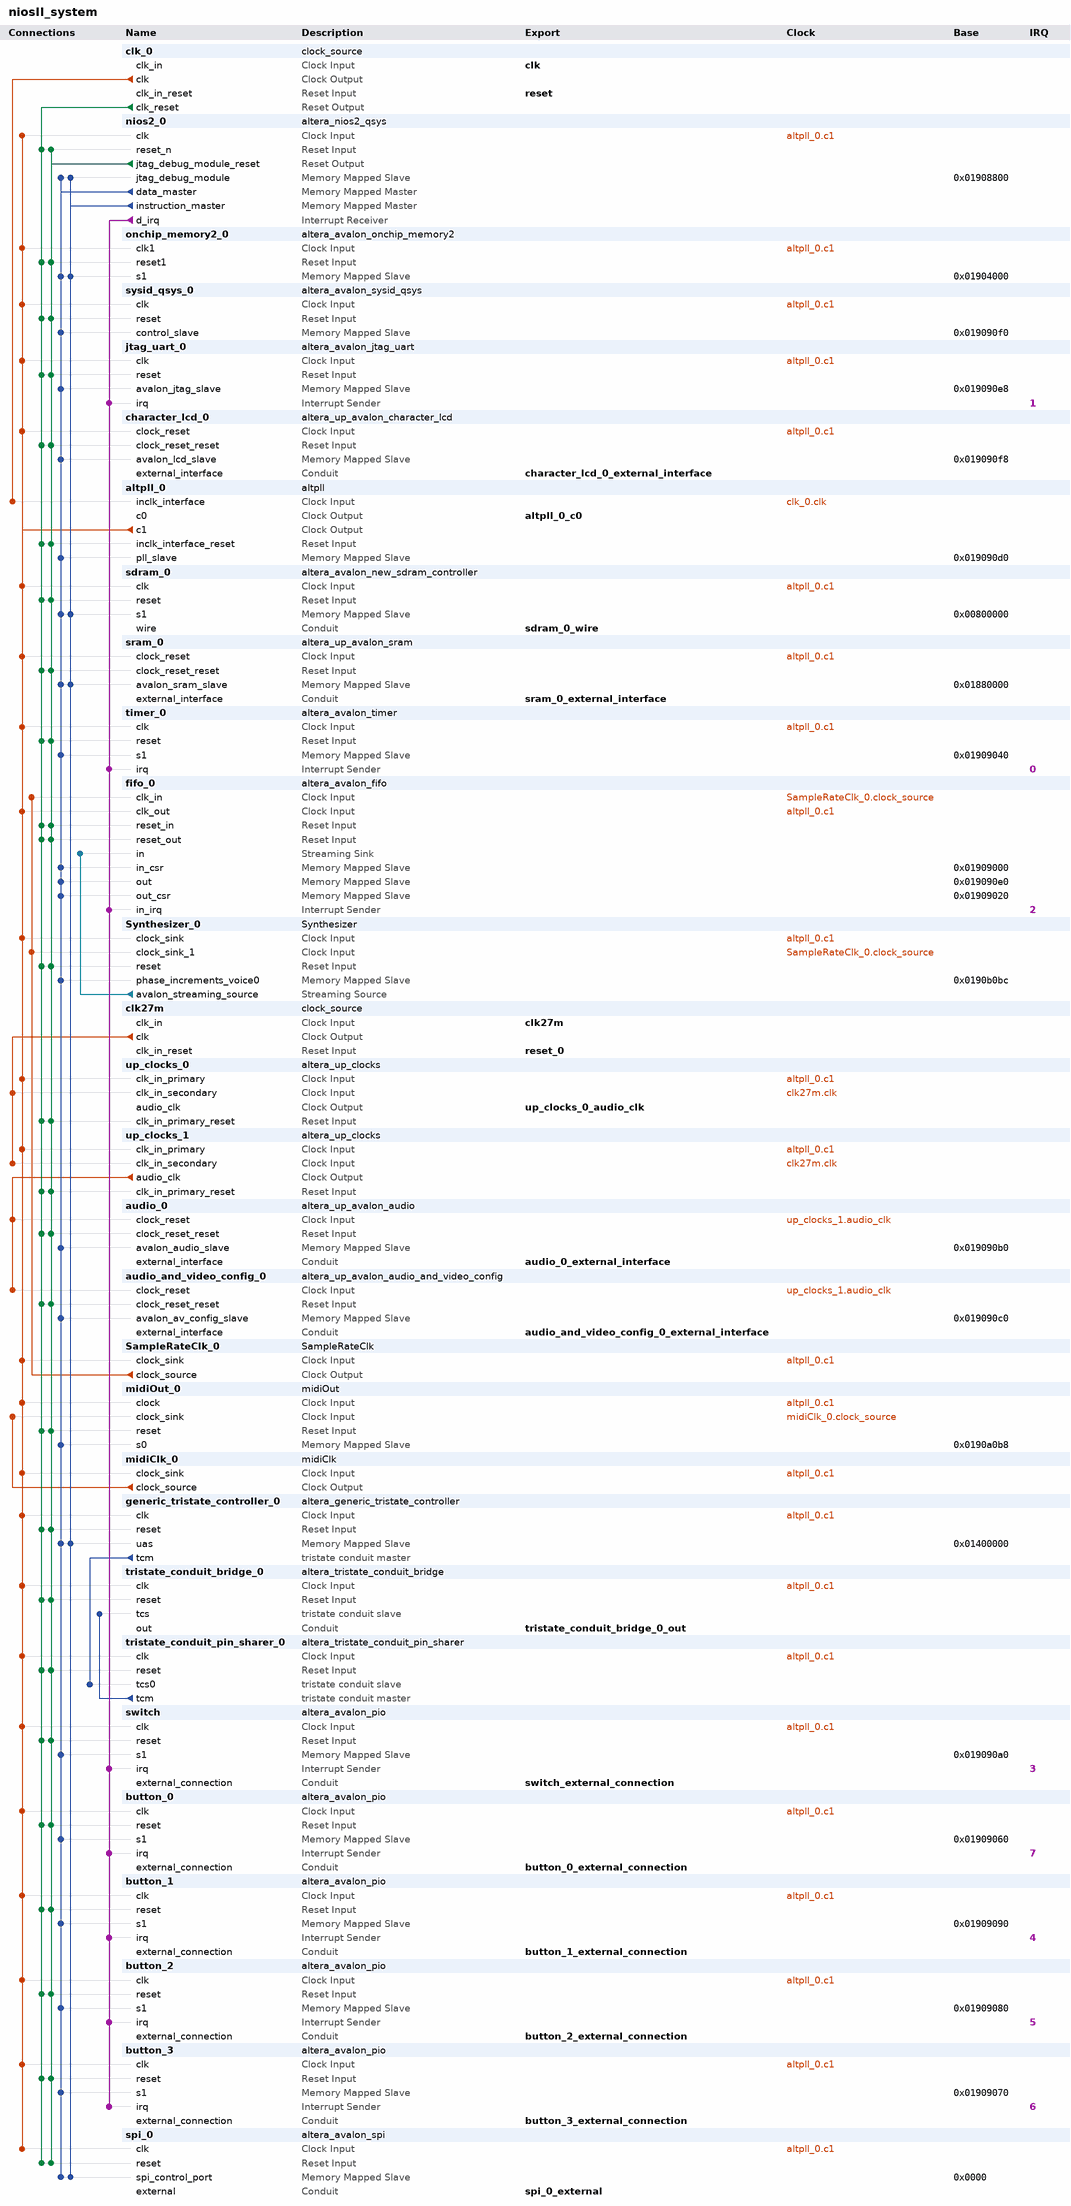
[diagram p0: system contents]
# Platform Designer (Qsys) system niosII_system, Cyclone II EP2C35F672C6
# Parameters at their usual value, and those the tool derives, are not listed.
package require -exact qsys 12.1
create_system niosII_system
set_project_property DEVICE_FAMILY {Cyclone II}
set_project_property DEVICE EP2C35F672C6

add_instance clk_0 clock_source 12.1
set_instance_parameter_value clk_0 clockFrequency 50000000

add_instance nios2_0 altera_nios2_qsys 12.1
set_instance_parameter_value nios2_0 resetSlave generic_tristate_controller_0.uas
set_instance_parameter_value nios2_0 exceptionSlave onchip_memory2_0.s1
set_instance_parameter_value nios2_0 breakSlave nios2_0.jtag_debug_module
set_instance_parameter_value nios2_0 impl Fast
set_instance_parameter_value nios2_0 icache_size 4096

add_instance onchip_memory2_0 altera_avalon_onchip_memory2 12.1
set_instance_parameter_value onchip_memory2_0 dataWidth 32
set_instance_parameter_value onchip_memory2_0 dualPort false
set_instance_parameter_value onchip_memory2_0 initMemContent true
set_instance_parameter_value onchip_memory2_0 initializationFileName onchip_memory2_0
set_instance_parameter_value onchip_memory2_0 memorySize 16384

add_instance sysid_qsys_0 altera_avalon_sysid_qsys 12.1
set_instance_parameter_value sysid_qsys_0 id 0

add_instance jtag_uart_0 altera_avalon_jtag_uart 12.1
set_instance_parameter_value jtag_uart_0 simInteractiveOptions INTERACTIVE_INPUT_OUTPUT

add_instance character_lcd_0 altera_up_avalon_character_lcd 12.0
set_instance_parameter_value character_lcd_0 cursor Normal

add_instance altpll_0 altpll 12.1
set_instance_parameter_value altpll_0 INCLK0_INPUT_FREQUENCY 20000
set_instance_parameter_value altpll_0 GATE_LOCK_SIGNAL NO
set_instance_parameter_value altpll_0 VALID_LOCK_MULTIPLIER 1
set_instance_parameter_value altpll_0 INVALID_LOCK_MULTIPLIER 5
set_instance_parameter_value altpll_0 CLK0_MULTIPLY_BY 1
set_instance_parameter_value altpll_0 CLK1_MULTIPLY_BY 1
set_instance_parameter_value altpll_0 CLK0_DIVIDE_BY 1
set_instance_parameter_value altpll_0 CLK1_DIVIDE_BY 1
set_instance_parameter_value altpll_0 CLK0_PHASE_SHIFT -3000
set_instance_parameter_value altpll_0 CLK1_PHASE_SHIFT 0
set_instance_parameter_value altpll_0 CLK1_DUTY_CYCLE 50
set_instance_parameter_value altpll_0 PORT_clk1 PORT_USED
set_instance_parameter_value altpll_0 PORT_clk2 PORT_UNUSED
set_instance_parameter_value altpll_0 PORT_clk3 PORT_UNUSED
set_instance_parameter_value altpll_0 PORT_ARESET PORT_UNUSED
set_instance_parameter_value altpll_0 PORT_LOCKED PORT_UNUSED

add_instance sdram_0 altera_avalon_new_sdram_controller 12.1
set_instance_parameter_value sdram_0 TAC 5.5
set_instance_parameter_value sdram_0 TRCD 20.0
set_instance_parameter_value sdram_0 TRP 20.0
set_instance_parameter_value sdram_0 casLatency 3
set_instance_parameter_value sdram_0 columnWidth 8
set_instance_parameter_value sdram_0 dataWidth 16
set_instance_parameter_value sdram_0 generateSimulationModel false
set_instance_parameter_value sdram_0 model custom
set_instance_parameter_value sdram_0 numberOfBanks 4
set_instance_parameter_value sdram_0 numberOfChipSelects 1
set_instance_parameter_value sdram_0 powerUpDelay 100.0
set_instance_parameter_value sdram_0 refreshPeriod 15.625
set_instance_parameter_value sdram_0 rowWidth 12

add_instance sram_0 altera_up_avalon_sram 12.0
set_instance_parameter_value sram_0 board DE2
set_instance_parameter_value sram_0 pixel_buffer false

add_instance timer_0 altera_avalon_timer 12.1
set_instance_parameter_value timer_0 period 1
set_instance_parameter_value timer_0 periodUnits MSEC
set_instance_parameter_value timer_0 timerPreset CUSTOM

add_instance fifo_0 altera_avalon_fifo 12.1
set_instance_parameter_value fifo_0 bitsPerSymbol 32
set_instance_parameter_value fifo_0 channelWidth 0
set_instance_parameter_value fifo_0 errorWidth 0
set_instance_parameter_value fifo_0 fifoDepth 128
set_instance_parameter_value fifo_0 fifoInputInterfaceOptions AVALONST_SINK
set_instance_parameter_value fifo_0 fifoOutputInterfaceOptions AVALONMM_READ
set_instance_parameter_value fifo_0 singleClockMode false
set_instance_parameter_value fifo_0 symbolsPerBeat 1
set_instance_parameter_value fifo_0 useBackpressure false
set_instance_parameter_value fifo_0 useIRQ true
set_instance_parameter_value fifo_0 usePacket false
set_instance_parameter_value fifo_0 useReadControl true

add_instance Synthesizer_0 Synthesizer 1.0

add_instance clk27m clock_source 12.1
set_instance_parameter_value clk27m clockFrequency 27000000

add_instance up_clocks_0 altera_up_clocks 12.0
set_instance_parameter_value up_clocks_0 board DE2
set_instance_parameter_value up_clocks_0 sdram_clk false
set_instance_parameter_value up_clocks_0 vga_clk false
set_instance_parameter_value up_clocks_0 audio_clk true
set_instance_parameter_value up_clocks_0 audio_clk_freq 12.288

add_instance up_clocks_1 altera_up_clocks 12.0
set_instance_parameter_value up_clocks_1 board DE2
set_instance_parameter_value up_clocks_1 sdram_clk false
set_instance_parameter_value up_clocks_1 vga_clk false
set_instance_parameter_value up_clocks_1 audio_clk true
set_instance_parameter_value up_clocks_1 audio_clk_freq 12.288

add_instance audio_0 altera_up_avalon_audio 12.0
set_instance_parameter_value audio_0 avalon_bus_type {Memory Mapped}
set_instance_parameter_value audio_0 audio_in true
set_instance_parameter_value audio_0 dw 16

add_instance audio_and_video_config_0 altera_up_avalon_audio_and_video_config 12.0
set_instance_parameter_value audio_and_video_config_0 board DE2
set_instance_parameter_value audio_and_video_config_0 audio_in {Microphone to ADC}
set_instance_parameter_value audio_and_video_config_0 line_in_bypass false
set_instance_parameter_value audio_and_video_config_0 bit_length 16
set_instance_parameter_value audio_and_video_config_0 sampling_rate {32 kHz}

add_instance SampleRateClk_0 SampleRateClk 1.0

add_instance midiOut_0 midiOut 1.0

add_instance midiClk_0 midiClk 1.0

add_instance generic_tristate_controller_0 altera_generic_tristate_controller 12.1
set_instance_parameter_value generic_tristate_controller_0 TCM_ADDRESS_W 22
set_instance_parameter_value generic_tristate_controller_0 TCM_DATA_W 8
set_instance_parameter_value generic_tristate_controller_0 TCM_BYTEENABLE_W 1
set_instance_parameter_value generic_tristate_controller_0 TCM_READ_WAIT 160
set_instance_parameter_value generic_tristate_controller_0 TCM_WRITE_WAIT 160
set_instance_parameter_value generic_tristate_controller_0 TCM_SETUP_WAIT 40
set_instance_parameter_value generic_tristate_controller_0 TCM_DATA_HOLD 40
set_instance_parameter_value generic_tristate_controller_0 TCM_MAX_PENDING_READ_TRANSACTIONS 3
set_instance_parameter_value generic_tristate_controller_0 TCM_TURNAROUND_TIME 2
set_instance_parameter_value generic_tristate_controller_0 TCM_TIMING_UNITS 0
set_instance_parameter_value generic_tristate_controller_0 TCM_READLATENCY 2
set_instance_parameter_value generic_tristate_controller_0 TCM_SYMBOLS_PER_WORD 1
set_instance_parameter_value generic_tristate_controller_0 USE_READ 1
set_instance_parameter_value generic_tristate_controller_0 USE_BEGINTRANSFER 0
set_instance_parameter_value generic_tristate_controller_0 USE_BYTEENABLE 0
set_instance_parameter_value generic_tristate_controller_0 USE_OUTPUTENABLE 0
set_instance_parameter_value generic_tristate_controller_0 ACTIVE_LOW_READ 1
set_instance_parameter_value generic_tristate_controller_0 ACTIVE_LOW_BYTEENABLE 0
set_instance_parameter_value generic_tristate_controller_0 ACTIVE_LOW_OUTPUTENABLE 0
set_instance_parameter_value generic_tristate_controller_0 ACTIVE_LOW_BEGINTRANSFER 0
set_instance_parameter_value generic_tristate_controller_0 CHIPSELECT_THROUGH_READLATENCY 0
set_instance_parameter_value generic_tristate_controller_0 MODULE_ASSIGNMENT_KEYS embeddedsw.configuration.hwClassnameDriverSupportList,embeddedsw.configuration.isFlash,embeddedsw.configuration.isMemoryDevice,embeddedsw.configuration.isNonVolatileStorage
set_instance_parameter_value generic_tristate_controller_0 MODULE_ASSIGNMENT_VALUES "altera_avalon_lan91c111\\,altera_avalon_cfi_flash,1,1,1"
set_instance_parameter_value generic_tristate_controller_0 INTERFACE_ASSIGNMENT_KEYS embeddedsw.configuration.isFlash,embeddedsw.configuration.isMemoryDevice,embeddedsw.configuration.isNonVolatileStorage
set_instance_parameter_value generic_tristate_controller_0 INTERFACE_ASSIGNMENT_VALUES 1,1,1

add_instance tristate_conduit_bridge_0 altera_tristate_conduit_bridge 12.1

add_instance tristate_conduit_pin_sharer_0 altera_tristate_conduit_pin_sharer 12.1
set_instance_parameter_value tristate_conduit_pin_sharer_0 NUM_INTERFACES 1

add_instance switch altera_avalon_pio 12.1
set_instance_parameter_value switch captureEdge true
set_instance_parameter_value switch direction Input
set_instance_parameter_value switch edgeType ANY
set_instance_parameter_value switch generateIRQ true
set_instance_parameter_value switch irqType EDGE
set_instance_parameter_value switch width 8

add_instance button_0 altera_avalon_pio 12.1
set_instance_parameter_value button_0 captureEdge true
set_instance_parameter_value button_0 direction Input
set_instance_parameter_value button_0 edgeType FALLING
set_instance_parameter_value button_0 generateIRQ true
set_instance_parameter_value button_0 width 1

add_instance button_1 altera_avalon_pio 12.1
set_instance_parameter_value button_1 captureEdge true
set_instance_parameter_value button_1 direction Input
set_instance_parameter_value button_1 edgeType FALLING
set_instance_parameter_value button_1 generateIRQ true
set_instance_parameter_value button_1 irqType EDGE
set_instance_parameter_value button_1 width 1

add_instance button_2 altera_avalon_pio 12.1
set_instance_parameter_value button_2 captureEdge true
set_instance_parameter_value button_2 direction Input
set_instance_parameter_value button_2 edgeType FALLING
set_instance_parameter_value button_2 generateIRQ true
set_instance_parameter_value button_2 irqType EDGE
set_instance_parameter_value button_2 width 1

add_instance button_3 altera_avalon_pio 12.1
set_instance_parameter_value button_3 captureEdge true
set_instance_parameter_value button_3 direction Input
set_instance_parameter_value button_3 edgeType FALLING
set_instance_parameter_value button_3 generateIRQ true
set_instance_parameter_value button_3 width 1

add_instance spi_0 altera_avalon_spi 12.1
set_instance_parameter_value spi_0 clockPolarity 0
set_instance_parameter_value spi_0 dataWidth 32
set_instance_parameter_value spi_0 masterSPI true
set_instance_parameter_value spi_0 numberOfSlaves 1
set_instance_parameter_value spi_0 targetClockRate 128000

# connections
add_connection altpll_0.c1 button_0.clk clock
add_connection altpll_0.c1 button_1.clk clock
add_connection altpll_0.c1 button_2.clk clock
add_connection altpll_0.c1 button_3.clk clock
add_connection altpll_0.c1 character_lcd_0.clock_reset clock
add_connection altpll_0.c1 fifo_0.clk_out clock
add_connection altpll_0.c1 generic_tristate_controller_0.clk clock
add_connection altpll_0.c1 jtag_uart_0.clk clock
add_connection altpll_0.c1 midiClk_0.clock_sink clock
add_connection altpll_0.c1 midiOut_0.clock clock
add_connection altpll_0.c1 nios2_0.clk clock
add_connection altpll_0.c1 onchip_memory2_0.clk1 clock
add_connection altpll_0.c1 SampleRateClk_0.clock_sink clock
add_connection altpll_0.c1 sdram_0.clk clock
add_connection altpll_0.c1 spi_0.clk clock
add_connection altpll_0.c1 sram_0.clock_reset clock
add_connection altpll_0.c1 switch.clk clock
add_connection altpll_0.c1 Synthesizer_0.clock_sink clock
add_connection altpll_0.c1 sysid_qsys_0.clk clock
add_connection altpll_0.c1 timer_0.clk clock
add_connection altpll_0.c1 tristate_conduit_bridge_0.clk clock
add_connection altpll_0.c1 tristate_conduit_pin_sharer_0.clk clock
add_connection altpll_0.c1 up_clocks_0.clk_in_primary clock
add_connection altpll_0.c1 up_clocks_1.clk_in_primary clock
add_connection clk27m.clk up_clocks_0.clk_in_secondary clock
add_connection clk27m.clk up_clocks_1.clk_in_secondary clock
add_connection clk_0.clk altpll_0.inclk_interface clock
add_connection midiClk_0.clock_source midiOut_0.clock_sink clock
add_connection SampleRateClk_0.clock_source fifo_0.clk_in clock
add_connection SampleRateClk_0.clock_source Synthesizer_0.clock_sink_1 clock
add_connection up_clocks_1.audio_clk audio_0.clock_reset clock
add_connection up_clocks_1.audio_clk audio_and_video_config_0.clock_reset clock
add_connection clk_0.clk_reset altpll_0.inclk_interface_reset reset
add_connection clk_0.clk_reset audio_0.clock_reset_reset reset
add_connection clk_0.clk_reset audio_and_video_config_0.clock_reset_reset reset
add_connection clk_0.clk_reset button_0.reset reset
add_connection clk_0.clk_reset button_1.reset reset
add_connection clk_0.clk_reset button_2.reset reset
add_connection clk_0.clk_reset button_3.reset reset
add_connection clk_0.clk_reset character_lcd_0.clock_reset_reset reset
add_connection clk_0.clk_reset fifo_0.reset_in reset
add_connection clk_0.clk_reset fifo_0.reset_out reset
add_connection clk_0.clk_reset generic_tristate_controller_0.reset reset
add_connection clk_0.clk_reset jtag_uart_0.reset reset
add_connection clk_0.clk_reset midiOut_0.reset reset
add_connection clk_0.clk_reset nios2_0.reset_n reset
add_connection clk_0.clk_reset onchip_memory2_0.reset1 reset
add_connection clk_0.clk_reset sdram_0.reset reset
add_connection clk_0.clk_reset spi_0.reset reset
add_connection clk_0.clk_reset sram_0.clock_reset_reset reset
add_connection clk_0.clk_reset switch.reset reset
add_connection clk_0.clk_reset Synthesizer_0.reset reset
add_connection clk_0.clk_reset sysid_qsys_0.reset reset
add_connection clk_0.clk_reset timer_0.reset reset
add_connection clk_0.clk_reset tristate_conduit_bridge_0.reset reset
add_connection clk_0.clk_reset tristate_conduit_pin_sharer_0.reset reset
add_connection clk_0.clk_reset up_clocks_0.clk_in_primary_reset reset
add_connection clk_0.clk_reset up_clocks_1.clk_in_primary_reset reset
add_connection nios2_0.jtag_debug_module_reset altpll_0.inclk_interface_reset reset
add_connection nios2_0.jtag_debug_module_reset audio_0.clock_reset_reset reset
add_connection nios2_0.jtag_debug_module_reset audio_and_video_config_0.clock_reset_reset reset
add_connection nios2_0.jtag_debug_module_reset button_0.reset reset
add_connection nios2_0.jtag_debug_module_reset button_1.reset reset
add_connection nios2_0.jtag_debug_module_reset button_2.reset reset
add_connection nios2_0.jtag_debug_module_reset button_3.reset reset
add_connection nios2_0.jtag_debug_module_reset character_lcd_0.clock_reset_reset reset
add_connection nios2_0.jtag_debug_module_reset fifo_0.reset_in reset
add_connection nios2_0.jtag_debug_module_reset fifo_0.reset_out reset
add_connection nios2_0.jtag_debug_module_reset generic_tristate_controller_0.reset reset
add_connection nios2_0.jtag_debug_module_reset jtag_uart_0.reset reset
add_connection nios2_0.jtag_debug_module_reset midiOut_0.reset reset
add_connection nios2_0.jtag_debug_module_reset nios2_0.reset_n reset
add_connection nios2_0.jtag_debug_module_reset onchip_memory2_0.reset1 reset
add_connection nios2_0.jtag_debug_module_reset sdram_0.reset reset
add_connection nios2_0.jtag_debug_module_reset spi_0.reset reset
add_connection nios2_0.jtag_debug_module_reset sram_0.clock_reset_reset reset
add_connection nios2_0.jtag_debug_module_reset switch.reset reset
add_connection nios2_0.jtag_debug_module_reset Synthesizer_0.reset reset
add_connection nios2_0.jtag_debug_module_reset sysid_qsys_0.reset reset
add_connection nios2_0.jtag_debug_module_reset timer_0.reset reset
add_connection nios2_0.jtag_debug_module_reset tristate_conduit_bridge_0.reset reset
add_connection nios2_0.jtag_debug_module_reset tristate_conduit_pin_sharer_0.reset reset
add_connection nios2_0.jtag_debug_module_reset up_clocks_0.clk_in_primary_reset reset
add_connection nios2_0.jtag_debug_module_reset up_clocks_1.clk_in_primary_reset reset
add_connection nios2_0.data_master altpll_0.pll_slave avalon
set_connection_parameter_value nios2_0.data_master/altpll_0.pll_slave baseAddress 0x019090d0
add_connection nios2_0.data_master audio_0.avalon_audio_slave avalon
set_connection_parameter_value nios2_0.data_master/audio_0.avalon_audio_slave baseAddress 0x019090b0
add_connection nios2_0.data_master audio_and_video_config_0.avalon_av_config_slave avalon
set_connection_parameter_value nios2_0.data_master/audio_and_video_config_0.avalon_av_config_slave baseAddress 0x019090c0
add_connection nios2_0.data_master button_0.s1 avalon
set_connection_parameter_value nios2_0.data_master/button_0.s1 baseAddress 0x01909060
add_connection nios2_0.data_master button_1.s1 avalon
set_connection_parameter_value nios2_0.data_master/button_1.s1 baseAddress 0x01909090
add_connection nios2_0.data_master button_2.s1 avalon
set_connection_parameter_value nios2_0.data_master/button_2.s1 baseAddress 0x01909080
add_connection nios2_0.data_master button_3.s1 avalon
set_connection_parameter_value nios2_0.data_master/button_3.s1 baseAddress 0x01909070
add_connection nios2_0.data_master character_lcd_0.avalon_lcd_slave avalon
set_connection_parameter_value nios2_0.data_master/character_lcd_0.avalon_lcd_slave baseAddress 0x019090f8
add_connection nios2_0.data_master fifo_0.in_csr avalon
set_connection_parameter_value nios2_0.data_master/fifo_0.in_csr baseAddress 0x01909000
add_connection nios2_0.data_master fifo_0.out avalon
set_connection_parameter_value nios2_0.data_master/fifo_0.out baseAddress 0x019090e0
add_connection nios2_0.data_master fifo_0.out_csr avalon
set_connection_parameter_value nios2_0.data_master/fifo_0.out_csr baseAddress 0x01909020
add_connection nios2_0.data_master generic_tristate_controller_0.uas avalon
set_connection_parameter_value nios2_0.data_master/generic_tristate_controller_0.uas baseAddress 0x01400000
add_connection nios2_0.data_master jtag_uart_0.avalon_jtag_slave avalon
set_connection_parameter_value nios2_0.data_master/jtag_uart_0.avalon_jtag_slave baseAddress 0x019090e8
add_connection nios2_0.data_master midiOut_0.s0 avalon
set_connection_parameter_value nios2_0.data_master/midiOut_0.s0 baseAddress 0x0190a0b8
add_connection nios2_0.data_master nios2_0.jtag_debug_module avalon
set_connection_parameter_value nios2_0.data_master/nios2_0.jtag_debug_module baseAddress 0x01908800
add_connection nios2_0.data_master onchip_memory2_0.s1 avalon
set_connection_parameter_value nios2_0.data_master/onchip_memory2_0.s1 baseAddress 0x01904000
add_connection nios2_0.data_master sdram_0.s1 avalon
set_connection_parameter_value nios2_0.data_master/sdram_0.s1 baseAddress 0x00800000
add_connection nios2_0.data_master spi_0.spi_control_port avalon
set_connection_parameter_value nios2_0.data_master/spi_0.spi_control_port baseAddress 0x0000
add_connection nios2_0.data_master sram_0.avalon_sram_slave avalon
set_connection_parameter_value nios2_0.data_master/sram_0.avalon_sram_slave baseAddress 0x01880000
add_connection nios2_0.data_master switch.s1 avalon
set_connection_parameter_value nios2_0.data_master/switch.s1 baseAddress 0x019090a0
add_connection nios2_0.data_master Synthesizer_0.phase_increments_voice0 avalon
set_connection_parameter_value nios2_0.data_master/Synthesizer_0.phase_increments_voice0 baseAddress 0x0190b0bc
add_connection nios2_0.data_master sysid_qsys_0.control_slave avalon
set_connection_parameter_value nios2_0.data_master/sysid_qsys_0.control_slave baseAddress 0x019090f0
add_connection nios2_0.data_master timer_0.s1 avalon
set_connection_parameter_value nios2_0.data_master/timer_0.s1 baseAddress 0x01909040
add_connection nios2_0.instruction_master generic_tristate_controller_0.uas avalon
set_connection_parameter_value nios2_0.instruction_master/generic_tristate_controller_0.uas baseAddress 0x01400000
add_connection nios2_0.instruction_master nios2_0.jtag_debug_module avalon
set_connection_parameter_value nios2_0.instruction_master/nios2_0.jtag_debug_module baseAddress 0x01908800
add_connection nios2_0.instruction_master onchip_memory2_0.s1 avalon
set_connection_parameter_value nios2_0.instruction_master/onchip_memory2_0.s1 baseAddress 0x01904000
add_connection nios2_0.instruction_master sdram_0.s1 avalon
set_connection_parameter_value nios2_0.instruction_master/sdram_0.s1 baseAddress 0x00800000
add_connection nios2_0.instruction_master spi_0.spi_control_port avalon
set_connection_parameter_value nios2_0.instruction_master/spi_0.spi_control_port baseAddress 0x0000
add_connection nios2_0.instruction_master sram_0.avalon_sram_slave avalon
set_connection_parameter_value nios2_0.instruction_master/sram_0.avalon_sram_slave baseAddress 0x01880000
add_connection Synthesizer_0.avalon_streaming_source fifo_0.in avalon_streaming
add_connection nios2_0.d_irq button_0.irq interrupt
set_connection_parameter_value nios2_0.d_irq/button_0.irq irqNumber 7
add_connection nios2_0.d_irq button_1.irq interrupt
set_connection_parameter_value nios2_0.d_irq/button_1.irq irqNumber 4
add_connection nios2_0.d_irq button_2.irq interrupt
set_connection_parameter_value nios2_0.d_irq/button_2.irq irqNumber 5
add_connection nios2_0.d_irq button_3.irq interrupt
set_connection_parameter_value nios2_0.d_irq/button_3.irq irqNumber 6
add_connection nios2_0.d_irq fifo_0.in_irq interrupt
set_connection_parameter_value nios2_0.d_irq/fifo_0.in_irq irqNumber 2
add_connection nios2_0.d_irq jtag_uart_0.irq interrupt
set_connection_parameter_value nios2_0.d_irq/jtag_uart_0.irq irqNumber 1
add_connection nios2_0.d_irq switch.irq interrupt
set_connection_parameter_value nios2_0.d_irq/switch.irq irqNumber 3
add_connection nios2_0.d_irq timer_0.irq interrupt
set_connection_parameter_value nios2_0.d_irq/timer_0.irq irqNumber 0
add_connection generic_tristate_controller_0.tcm tristate_conduit_pin_sharer_0.tcs0 tristate_conduit
add_connection tristate_conduit_pin_sharer_0.tcm tristate_conduit_bridge_0.tcs tristate_conduit

# exported interfaces
add_interface clk clock sink
set_interface_property clk EXPORT_OF clk_0.clk_in
add_interface reset reset sink
set_interface_property reset EXPORT_OF clk_0.clk_in_reset
add_interface sdram_0_wire conduit end
set_interface_property sdram_0_wire EXPORT_OF sdram_0.wire
add_interface sram_0_external_interface conduit end
set_interface_property sram_0_external_interface EXPORT_OF sram_0.external_interface
add_interface altpll_0_c0 clock source
set_interface_property altpll_0_c0 EXPORT_OF altpll_0.c0
add_interface character_lcd_0_external_interface conduit end
set_interface_property character_lcd_0_external_interface EXPORT_OF character_lcd_0.external_interface
add_interface clk27m clock sink
set_interface_property clk27m EXPORT_OF clk27m.clk_in
add_interface reset_0 reset sink
set_interface_property reset_0 EXPORT_OF clk27m.clk_in_reset
add_interface up_clocks_0_audio_clk clock source
set_interface_property up_clocks_0_audio_clk EXPORT_OF up_clocks_0.audio_clk
add_interface audio_0_external_interface conduit end
set_interface_property audio_0_external_interface EXPORT_OF audio_0.external_interface
add_interface audio_and_video_config_0_external_interface conduit end
set_interface_property audio_and_video_config_0_external_interface EXPORT_OF audio_and_video_config_0.external_interface
add_interface switch_external_connection conduit end
set_interface_property switch_external_connection EXPORT_OF switch.external_connection
add_interface tristate_conduit_bridge_0_out conduit end
set_interface_property tristate_conduit_bridge_0_out EXPORT_OF tristate_conduit_bridge_0.out
add_interface button_3_external_connection conduit end
set_interface_property button_3_external_connection EXPORT_OF button_3.external_connection
add_interface button_2_external_connection conduit end
set_interface_property button_2_external_connection EXPORT_OF button_2.external_connection
add_interface button_1_external_connection conduit end
set_interface_property button_1_external_connection EXPORT_OF button_1.external_connection
add_interface button_0_external_connection conduit end
set_interface_property button_0_external_connection EXPORT_OF button_0.external_connection
add_interface spi_0_external conduit end
set_interface_property spi_0_external EXPORT_OF spi_0.external

save_system niosII_system.qsys
